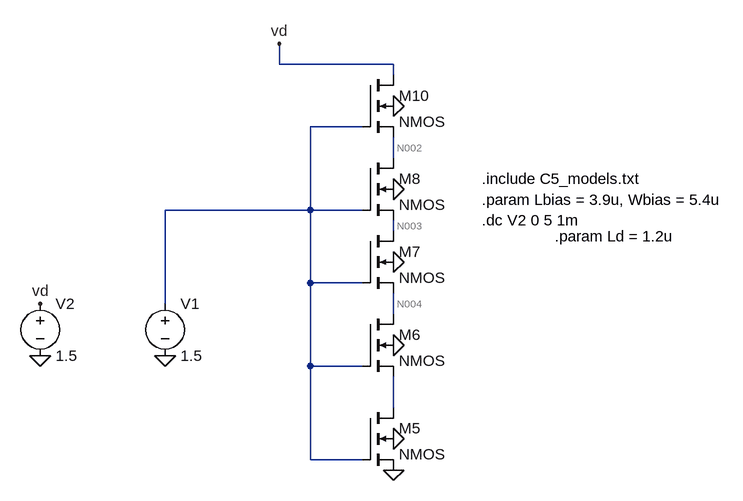
[diagram p0: schematic column_vias.asc]
column_vias.asc, the LTspice schematic file:
Version 4
SHEET 1 964 680
WIRE 240 -368 240 -400
WIRE 416 -368 240 -368
WIRE 416 -352 416 -368
WIRE 368 -272 288 -272
WIRE 416 -224 416 -256
WIRE 288 -144 288 -272
WIRE 288 -144 64 -144
WIRE 368 -144 288 -144
WIRE 416 -112 416 -128
WIRE 288 -32 288 -144
WIRE 368 -32 288 -32
WIRE 64 0 64 -144
WIRE 416 16 416 -16
WIRE 288 96 288 -32
WIRE 368 96 288 96
WIRE 416 160 416 112
WIRE 288 240 288 96
WIRE 368 240 288 240
FLAG 64 80 0
FLAG 240 -400 vd
FLAG 416 256 0
FLAG 416 208 0
FLAG 416 64 0
FLAG 416 -64 0
FLAG 416 -176 0
FLAG -128 80 0
FLAG -128 0 vd
FLAG 416 -304 0
SYMBOL voltage 64 -16 R0
SYMATTR InstName V1
SYMATTR Value 1.5
SYMBOL nmos4 368 160 R0
SYMATTR InstName M5
SYMATTR Value2 l='Lbias' w='Wbias' ad='Wbias*Ld' as='Wbias*Ld' pd='2*Wbias+2*Ld' ps='2*Wbias+2*Ld' m=1
SYMBOL nmos4 368 16 R0
SYMATTR InstName M6
SYMATTR Value2 l='Lbias' w='Wbias' ad='Wbias*Ld' as='Wbias*Ld' pd='2*Wbias+2*Ld' ps='2*Wbias+2*Ld' m=1
SYMBOL nmos4 368 -112 R0
SYMATTR InstName M7
SYMATTR Value2 l='Lbias' w='Wbias' ad='Wbias*Ld' as='Wbias*Ld' pd='2*Wbias+2*Ld' ps='2*Wbias+2*Ld' m=1
SYMBOL nmos4 368 -224 R0
SYMATTR InstName M8
SYMATTR Value2 l='Lbias' w='Wbias' ad='Wbias*Ld' as='Wbias*Ld' pd='2*Wbias+2*Ld' ps='2*Wbias+2*Ld' m=1
SYMBOL voltage -128 -16 R0
SYMATTR InstName V2
SYMATTR Value 1.5
SYMBOL nmos4 368 -352 R0
SYMATTR InstName M10
SYMATTR Value2 l='Lbias' w='Wbias' ad='Wbias*Ld' as='Wbias*Ld' pd='2*Wbias+2*Ld' ps='2*Wbias+2*Ld' m=1
TEXT 552 -192 Left 2 !.include C5_models.txt
TEXT 552 -160 Left 2 !.param Lbias = 3.9u, Wbias = 5.4u
TEXT 552 -128 Left 2 !.dc V2 0 5 1m
TEXT 664 -104 Left 2 !.param Ld = 1.2u

The netlist it stands for:
* column_vias.asc
V1 N001 0 1.5
M5 N005 N001 0 0 NMOS l='Lbias' w='Wbias' ad='Wbias*Ld' as='Wbias*Ld' pd='2*Wbias+2*Ld' ps='2*Wbias+2*Ld' m=1
M6 N004 N001 N005 0 NMOS l='Lbias' w='Wbias' ad='Wbias*Ld' as='Wbias*Ld' pd='2*Wbias+2*Ld' ps='2*Wbias+2*Ld' m=1
M7 N003 N001 N004 0 NMOS l='Lbias' w='Wbias' ad='Wbias*Ld' as='Wbias*Ld' pd='2*Wbias+2*Ld' ps='2*Wbias+2*Ld' m=1
M8 N002 N001 N003 0 NMOS l='Lbias' w='Wbias' ad='Wbias*Ld' as='Wbias*Ld' pd='2*Wbias+2*Ld' ps='2*Wbias+2*Ld' m=1
V2 vd 0 1.5
M10 vd N001 N002 0 NMOS l='Lbias' w='Wbias' ad='Wbias*Ld' as='Wbias*Ld' pd='2*Wbias+2*Ld' ps='2*Wbias+2*Ld' m=1
.model NMOS NMOS
.model PMOS PMOS
.lib standard.mos
.include C5_models.txt
.param Lbias = 3.9u, Wbias = 5.4u
.dc V2 0 5 1m
.param Ld = 1.2u
.backanno
.end

* Results of the author's LTspice run, read from the files saved beside the schematic
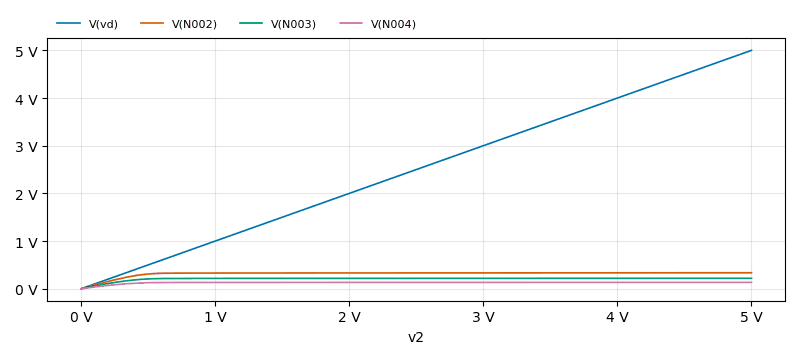
[diagram p1: DC transfer characteristic of column_vias.asc, plotted from the saved traces]
* DC transfer characteristic, 1 run:
*   V(vd): 0 V at v2=0 V, 5 V at v2=5 V, min 0 V, max 5 V
*   V(N002): -2.96e-13 fV at v2=0 V, 336.5 mV at v2=5 V, min -2.96e-13 fV, max 336.5 mV
*   V(N003): -3.132e-13 fV at v2=0 V, 221.1 mV at v2=5 V, min -3.132e-13 fV, max 221.1 mV
*   V(N004): -3.327e-13 fV at v2=0 V, 134.9 mV at v2=5 V, min -3.327e-13 fV, max 134.9 mV